# EAGLE design simpleglitcher (EAGLE 6.6.0)
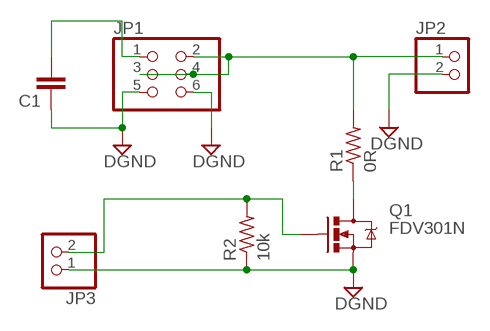
[diagram p0: schematic, sheet 1]

## Parts
C1  C-EUC0603  [C0603]
JP1  PINHD-2X3  [2X03]
JP2  PINHD-1X2  [1X02]
JP3  PINHD-1X2  [1X02]
Q1  FDV301N  MOSFET-NCHANNELSMD  [SOT23-3]
R1  0R  R-US_R0603  [R0603]
R2  10k  R-US_R0603  [R0603]

## Nets
DGND: C1.1 JP1.5 JP1.6 JP2.2 JP3.1 Q1.2(S) R2.1
N$1: JP1.2 JP1.3 JP1.4 JP2.1 R1.2
N$2: Q1.3(D) R1.1
N$3: C1.2 JP1.1
N$5: JP3.2 Q1.1(G) R2.2

## Library data of the parts
C1 = resistor:C-EU: CAPACITOR, European symbol
JP1 = pinhead:PINHD-2X3: PIN HEADER
JP2 JP3 = pinhead:PINHD-1X2: PIN HEADER
Q1 = SparkFun:MOSFET-NCHANNEL
R1 R2 = resistor:R-US_: RESISTOR, American symbol

## Board
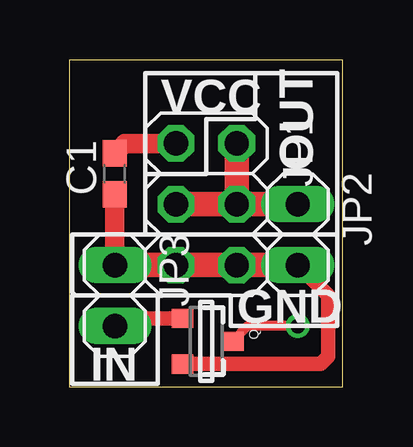
[diagram p1: board, top side]
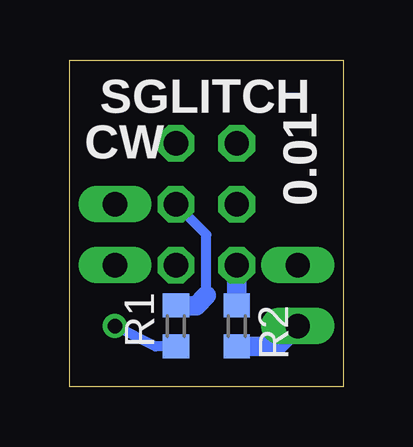
[diagram p2: board, bottom side, seen from below]

Size 11.41 x 13.64 mm. Coordinates in mm from the lower left corner, seen from the top.
Outline: 0,0 11.41,0 11.41,13.64 0,13.64 0,0
Copper layers (1*16): Top 0.035mm / dielectric 1.5mm / Bottom 0.035mm
Design rules "default": minimum track width 10mil, minimum drill 24mil, track to track 8mil, track to pad 8mil, pad to pad 8mil, via to via 8mil, smd to smd 8mil, copper to edge 40mil, drill to drill 8mil, minimum pad ring 10mil, minimum via ring 8mil, stop-mask expansion 4mil, vias tented up to drill 0mil, thermal gap 10mil

### Footprints (pad centres in the part's own frame; a part is rotated, then mirrored left to right if it is on the bottom)
C0603 = smd 1.1 x 1: 1 -0.85,0; 2 0.85,0
2X03 = drill 1.016 octagon: 1 -2.54,-1.27; 2 -2.54,1.27; 3 0,-1.27; 4 0,1.27; 5 2.54,-1.27; 6 2.54,1.27
1X02 = drill 1.016 long: 1 -1.27,0; 2 1.27,0
SOT23-3 = smd 0.8 x 0.9: 1 -0.95,-1; 2 0.95,-1; 3 0,1.1
R0603 = smd 1 x 1.1: 1 -0.85,0; 2 0.85,0

### Placement (x,y rotation side)
C1  1.91,8.89 90 top
JP1  5.72,7.62 270 top
JP2  9.52,6.35 270 top
JP3  1.91,3.81 270 top
Q1  5.72,1.9 270 top
R1  6.98,2.54 90 bottom
R2  4.45,2.54 270 bottom

### Tracks (layer width: path | path; a pad name or v marks a point on that pad's centre or on a via)
DGND
  Top 0.61: Q1.2 10.48,0.95 10.8,1.27 10.8,3.81 JP2.2
  Top 0.813: C1.1 JP3.1
  Top 1.016: JP3.1 JP1.5 JP1.6 JP2.2
  Bottom 0.813: R2.1 JP1.5
N$1
  Top 1.016: JP2.1 JP1.4 | JP1.3 JP1.4 | JP1.2 JP1.4
  Bottom 0.406: 5.72,3.81 5.72,6.35 JP1.4
  Bottom 0.813: R1.2 6.14,3.39 5.72,3.81
N$2  (via drill 0.6)
  Top 0.406: v9.52,2.54 7.45,2.54 Q1.3
  Bottom 0.406: R1.1 7.84,1.69 v9.52,2.54
N$3
  Top 0.813: JP1.1 2.33,10.16 C1.2
N$5
  Top 0.61: Q1.1 2.22,2.85 JP3.2
  Bottom 0.813: R2.2 2.76,1.69 JP3.2

### Text on the board
bPlace: 0.01 | SGLITCH | CW
tPlaceReal: VCC | OUT | GND | IN